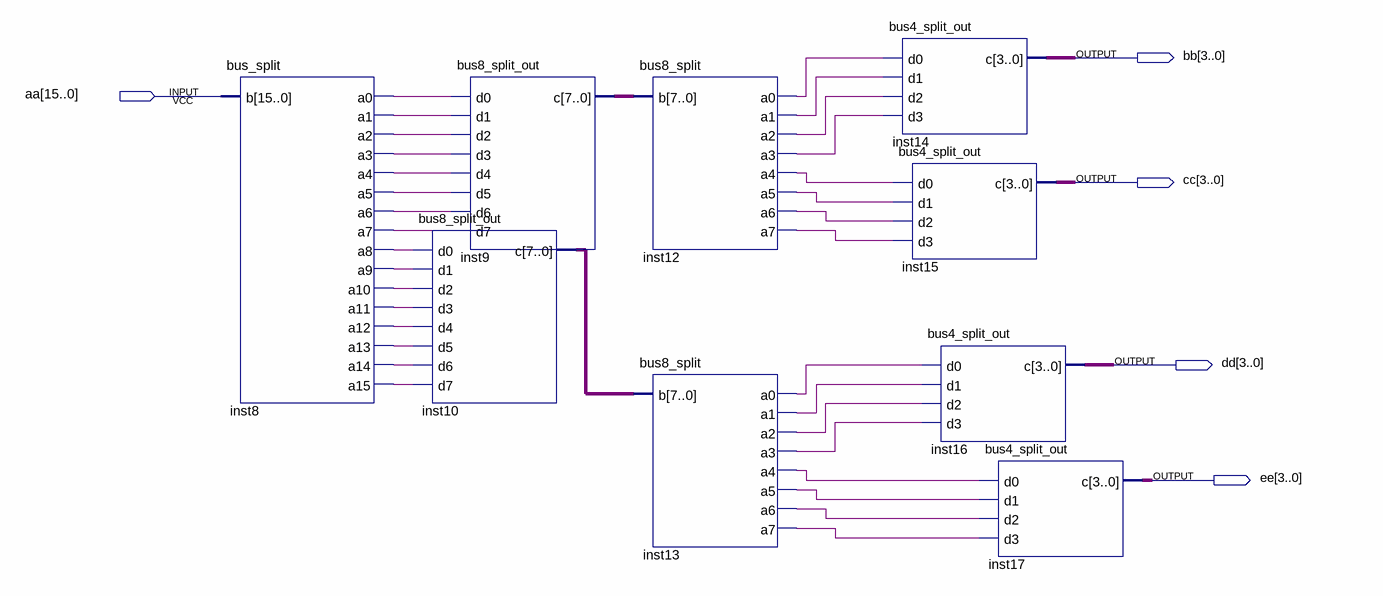
[diagram p0: schematic sheet]
// Quartus schematic bus16_4.bdf as structural Verilog: 9 symbols, 5 pins
module bus16_4 (
  input  [15:0] aa,
  output [3:0] bb,
  output [3:0] cc,
  output [3:0] dd,
  output [3:0] ee
);

  wire inst8_a0, inst8_a1, inst8_a2, inst8_a3, inst8_a4, inst8_a5, inst8_a6, inst8_a7, inst8_a8, inst8_a9,
       inst8_a10, inst8_a11, inst8_a12, inst8_a13, inst8_a14, inst8_a15, inst12_a0, inst12_a1, inst12_a2,
       inst12_a3, inst12_a4, inst12_a5, inst12_a6, inst12_a7, inst13_a0, inst13_a1, inst13_a2, inst13_a3,
       inst13_a4, inst13_a5, inst13_a6, inst13_a7;
  wire [7:0] inst9_c, inst10_c;

  bus_split inst8 (
    .b(aa), .a0(inst8_a0), .a1(inst8_a1), .a2(inst8_a2), .a3(inst8_a3), .a4(inst8_a4), .a5(inst8_a5),
    .a6(inst8_a6), .a7(inst8_a7), .a8(inst8_a8), .a9(inst8_a9), .a10(inst8_a10), .a11(inst8_a11),
    .a12(inst8_a12), .a13(inst8_a13), .a14(inst8_a14), .a15(inst8_a15));
  bus8_split_out inst10 (
    .d0(inst8_a8), .d1(inst8_a9), .d2(inst8_a10), .d3(inst8_a11), .d4(inst8_a12), .d5(inst8_a13),
    .d6(inst8_a14), .d7(inst8_a15), .c(inst10_c));
  bus8_split_out inst9 (
    .d0(inst8_a0), .d1(inst8_a1), .d2(inst8_a2), .d3(inst8_a3), .d4(inst8_a4), .d5(inst8_a5), .d6(inst8_a6),
    .d7(inst8_a7), .c(inst9_c));
  bus8_split inst12 (
    .b(inst9_c), .a0(inst12_a0), .a1(inst12_a1), .a2(inst12_a2), .a3(inst12_a3), .a4(inst12_a4),
    .a5(inst12_a5), .a6(inst12_a6), .a7(inst12_a7));
  bus8_split inst13 (
    .b(inst10_c), .a0(inst13_a0), .a1(inst13_a1), .a2(inst13_a2), .a3(inst13_a3), .a4(inst13_a4),
    .a5(inst13_a5), .a6(inst13_a6), .a7(inst13_a7));
  bus4_split_out inst14 (.d0(inst12_a0), .d1(inst12_a1), .d2(inst12_a2), .d3(inst12_a3), .c(bb));
  bus4_split_out inst15 (.d0(inst12_a4), .d1(inst12_a5), .d2(inst12_a6), .d3(inst12_a7), .c(cc));
  bus4_split_out inst16 (.d0(inst13_a0), .d1(inst13_a1), .d2(inst13_a2), .d3(inst13_a3), .c(dd));
  bus4_split_out inst17 (.d0(inst13_a4), .d1(inst13_a5), .d2(inst13_a6), .d3(inst13_a7), .c(ee));
endmodule
